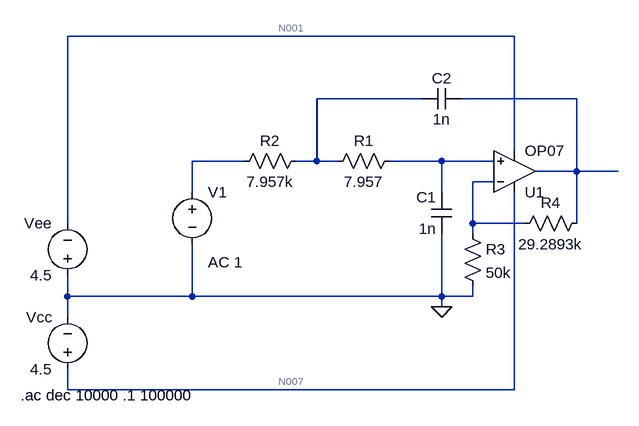
[diagram p0: schematic SallenAndKeyOrder2.asc]
SallenAndKeyOrder2.asc, the LTspice schematic file:
Version 4
SHEET 1 880 680
WIRE 192 -48 -496 -48
WIRE 48 48 -112 48
WIRE 288 48 112 48
WIRE 192 128 192 -48
WIRE -224 144 -304 144
WIRE -112 144 -112 48
WIRE -112 144 -144 144
WIRE -80 144 -112 144
WIRE 80 144 0 144
WIRE 160 144 80 144
WIRE 288 160 288 48
WIRE 288 160 224 160
WIRE 352 160 288 160
WIRE 160 176 128 176
WIRE -304 192 -304 144
WIRE 80 192 80 144
WIRE -496 240 -496 -48
WIRE 128 240 128 176
WIRE 208 240 128 240
WIRE 288 240 288 160
WIRE 128 256 128 240
WIRE -496 352 -496 320
WIRE -304 352 -304 272
WIRE -304 352 -496 352
WIRE 80 352 80 256
WIRE 80 352 -304 352
WIRE 128 352 128 336
WIRE 128 352 80 352
WIRE 80 368 80 352
WIRE -496 384 -496 352
WIRE -496 496 -496 464
WIRE 192 496 192 192
WIRE 192 496 -496 496
FLAG 80 368 0
SYMBOL Opamps\\OP07 192 224 M180
SYMATTR InstName U1
SYMBOL res 16 128 R90
WINDOW 0 0 56 VBottom 2
WINDOW 3 32 56 VTop 2
SYMATTR InstName R1
SYMATTR Value 7.957
SYMBOL res -128 128 R90
WINDOW 0 0 56 VBottom 2
WINDOW 3 32 56 VTop 2
SYMATTR InstName R2
SYMATTR Value 7.957k
SYMBOL cap 96 192 M0
SYMATTR InstName C1
SYMATTR Value 1n
SYMBOL res 112 240 R0
SYMATTR InstName R3
SYMATTR Value 50k
SYMBOL res 304 224 R90
WINDOW 0 0 56 VBottom 2
WINDOW 3 32 56 VTop 2
SYMATTR InstName R4
SYMATTR Value 29.2893k
SYMBOL cap 48 64 R270
WINDOW 0 32 32 VTop 2
WINDOW 3 0 32 VBottom 2
SYMATTR InstName C2
SYMATTR Value 1n
SYMBOL voltage -304 176 R0
WINDOW 123 24 124 Left 2
WINDOW 39 0 0 Left 2
SYMATTR Value2 AC 1
SYMATTR InstName V1
SYMATTR Value ""
SYMBOL voltage -496 336 R180
WINDOW 0 24 96 Left 2
WINDOW 3 24 16 Left 2
SYMATTR InstName Vee
SYMATTR Value 4.5
SYMBOL voltage -496 480 R180
WINDOW 0 24 96 Left 2
WINDOW 3 24 16 Left 2
SYMATTR InstName Vcc
SYMATTR Value 4.5
TEXT -568 504 Left 2 !.ac dec 10000 .1 100000

The netlist it stands for:
* SallenAndKeyOrder2.asc
XU1 N005 N006 N007 N001 N003 LT1001  ; OP07, pins In+ In- V+ V- OUT
R1 N005 N002 7.957
R2 N002 N004 7.957k
C1 N005 0 1n
R3 N006 0 50k
R4 N003 N006 29.2893k
C2 N002 N003 1n
V1 N004 0 AC 1
Vee 0 N001 4.5
Vcc N007 0 4.5
.ac dec 10000 .1 100000
.lib LTC.lib
.backanno
.end

* Results of the author's LTspice run, read from the files saved beside the schematic
* Operating Point, zero values left out:
*   V(n007) = 4.5 V
*   V(n001) = -4.5 V
*   I(Vcc) = -2.25 mA
*   I(Vee) = -2.25 mA
*   Ix(u1:3) = 2.25 mA
*   Ix(u1:4) = -2.25 mA